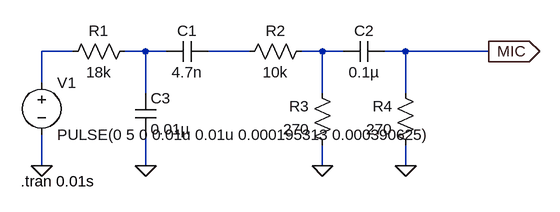
[diagram p0: schematic cmt-in.asc]
cmt-in.asc, the LTspice schematic file:
Version 4
SHEET 1 1884 680
WIRE 48 -112 0 -112
WIRE 160 -112 128 -112
WIRE 192 -112 160 -112
WIRE 320 -112 256 -112
WIRE 432 -112 400 -112
WIRE 464 -112 432 -112
WIRE 560 -112 528 -112
WIRE 688 -112 560 -112
WIRE 0 -64 0 -112
WIRE 160 -48 160 -112
WIRE 432 -48 432 -112
WIRE 560 -48 560 -112
WIRE 0 64 0 16
WIRE 160 64 160 16
WIRE 432 64 432 32
WIRE 560 64 560 32
FLAG 0 64 0
FLAG 432 64 0
FLAG 560 64 0
FLAG 160 64 0
FLAG 688 -112 MIC
IOPIN 688 -112 Out
SYMBOL voltage 0 -80 R0
WINDOW 123 0 0 Left 2
WINDOW 39 0 0 Left 2
SYMATTR InstName V1
SYMATTR Value PULSE(0 5 0 0.01u 0.01u 0.000195313 0.000390625)
SYMBOL res 144 -128 R90
WINDOW 0 0 56 VBottom 2
WINDOW 3 32 56 VTop 2
SYMATTR InstName R1
SYMATTR Value 18k
SYMBOL res 416 -128 R90
WINDOW 0 0 56 VBottom 2
WINDOW 3 32 56 VTop 2
SYMATTR InstName R2
SYMATTR Value 10k
SYMBOL res 448 48 R180
WINDOW 0 36 76 Left 2
WINDOW 3 36 40 Left 2
SYMATTR InstName R3
SYMATTR Value 270
SYMBOL res 576 48 R180
WINDOW 0 36 76 Left 2
WINDOW 3 36 40 Left 2
SYMATTR InstName R4
SYMATTR Value 270
SYMBOL cap 256 -128 R90
WINDOW 0 0 32 VBottom 2
WINDOW 3 32 32 VTop 2
SYMATTR InstName C1
SYMATTR Value 4.7n
SYMBOL cap 528 -128 R90
WINDOW 0 0 32 VBottom 2
WINDOW 3 32 32 VTop 2
SYMATTR InstName C2
SYMATTR Value 0.1µ
SYMBOL cap 144 -48 R0
SYMATTR InstName C3
SYMATTR Value 0.01µ
TEXT -32 88 Left 2 !.tran 0.01s

The netlist it stands for:
* cmt-in.asc
V1 N001 0 PULSE(0 5 0 0.01u 0.01u 0.000195313 0.000390625)
R1 N002 N001 18k
R2 N004 N003 10k
R3 0 N004 270
R4 0 MIC 270
C1 N003 N002 4.7n
C2 MIC N004 0.1µ
C3 N002 0 0.01µ
.tran 0.01s
.backanno
.end